# EasyEDA Pro project CameraTargetV3.eprj, schematic Schematic1
Create Date: 2023-05-23; Page Name: P1; Project Name: CameraTargetV3; Schematic Name: Schematic1; Update Date: 2023-05-31
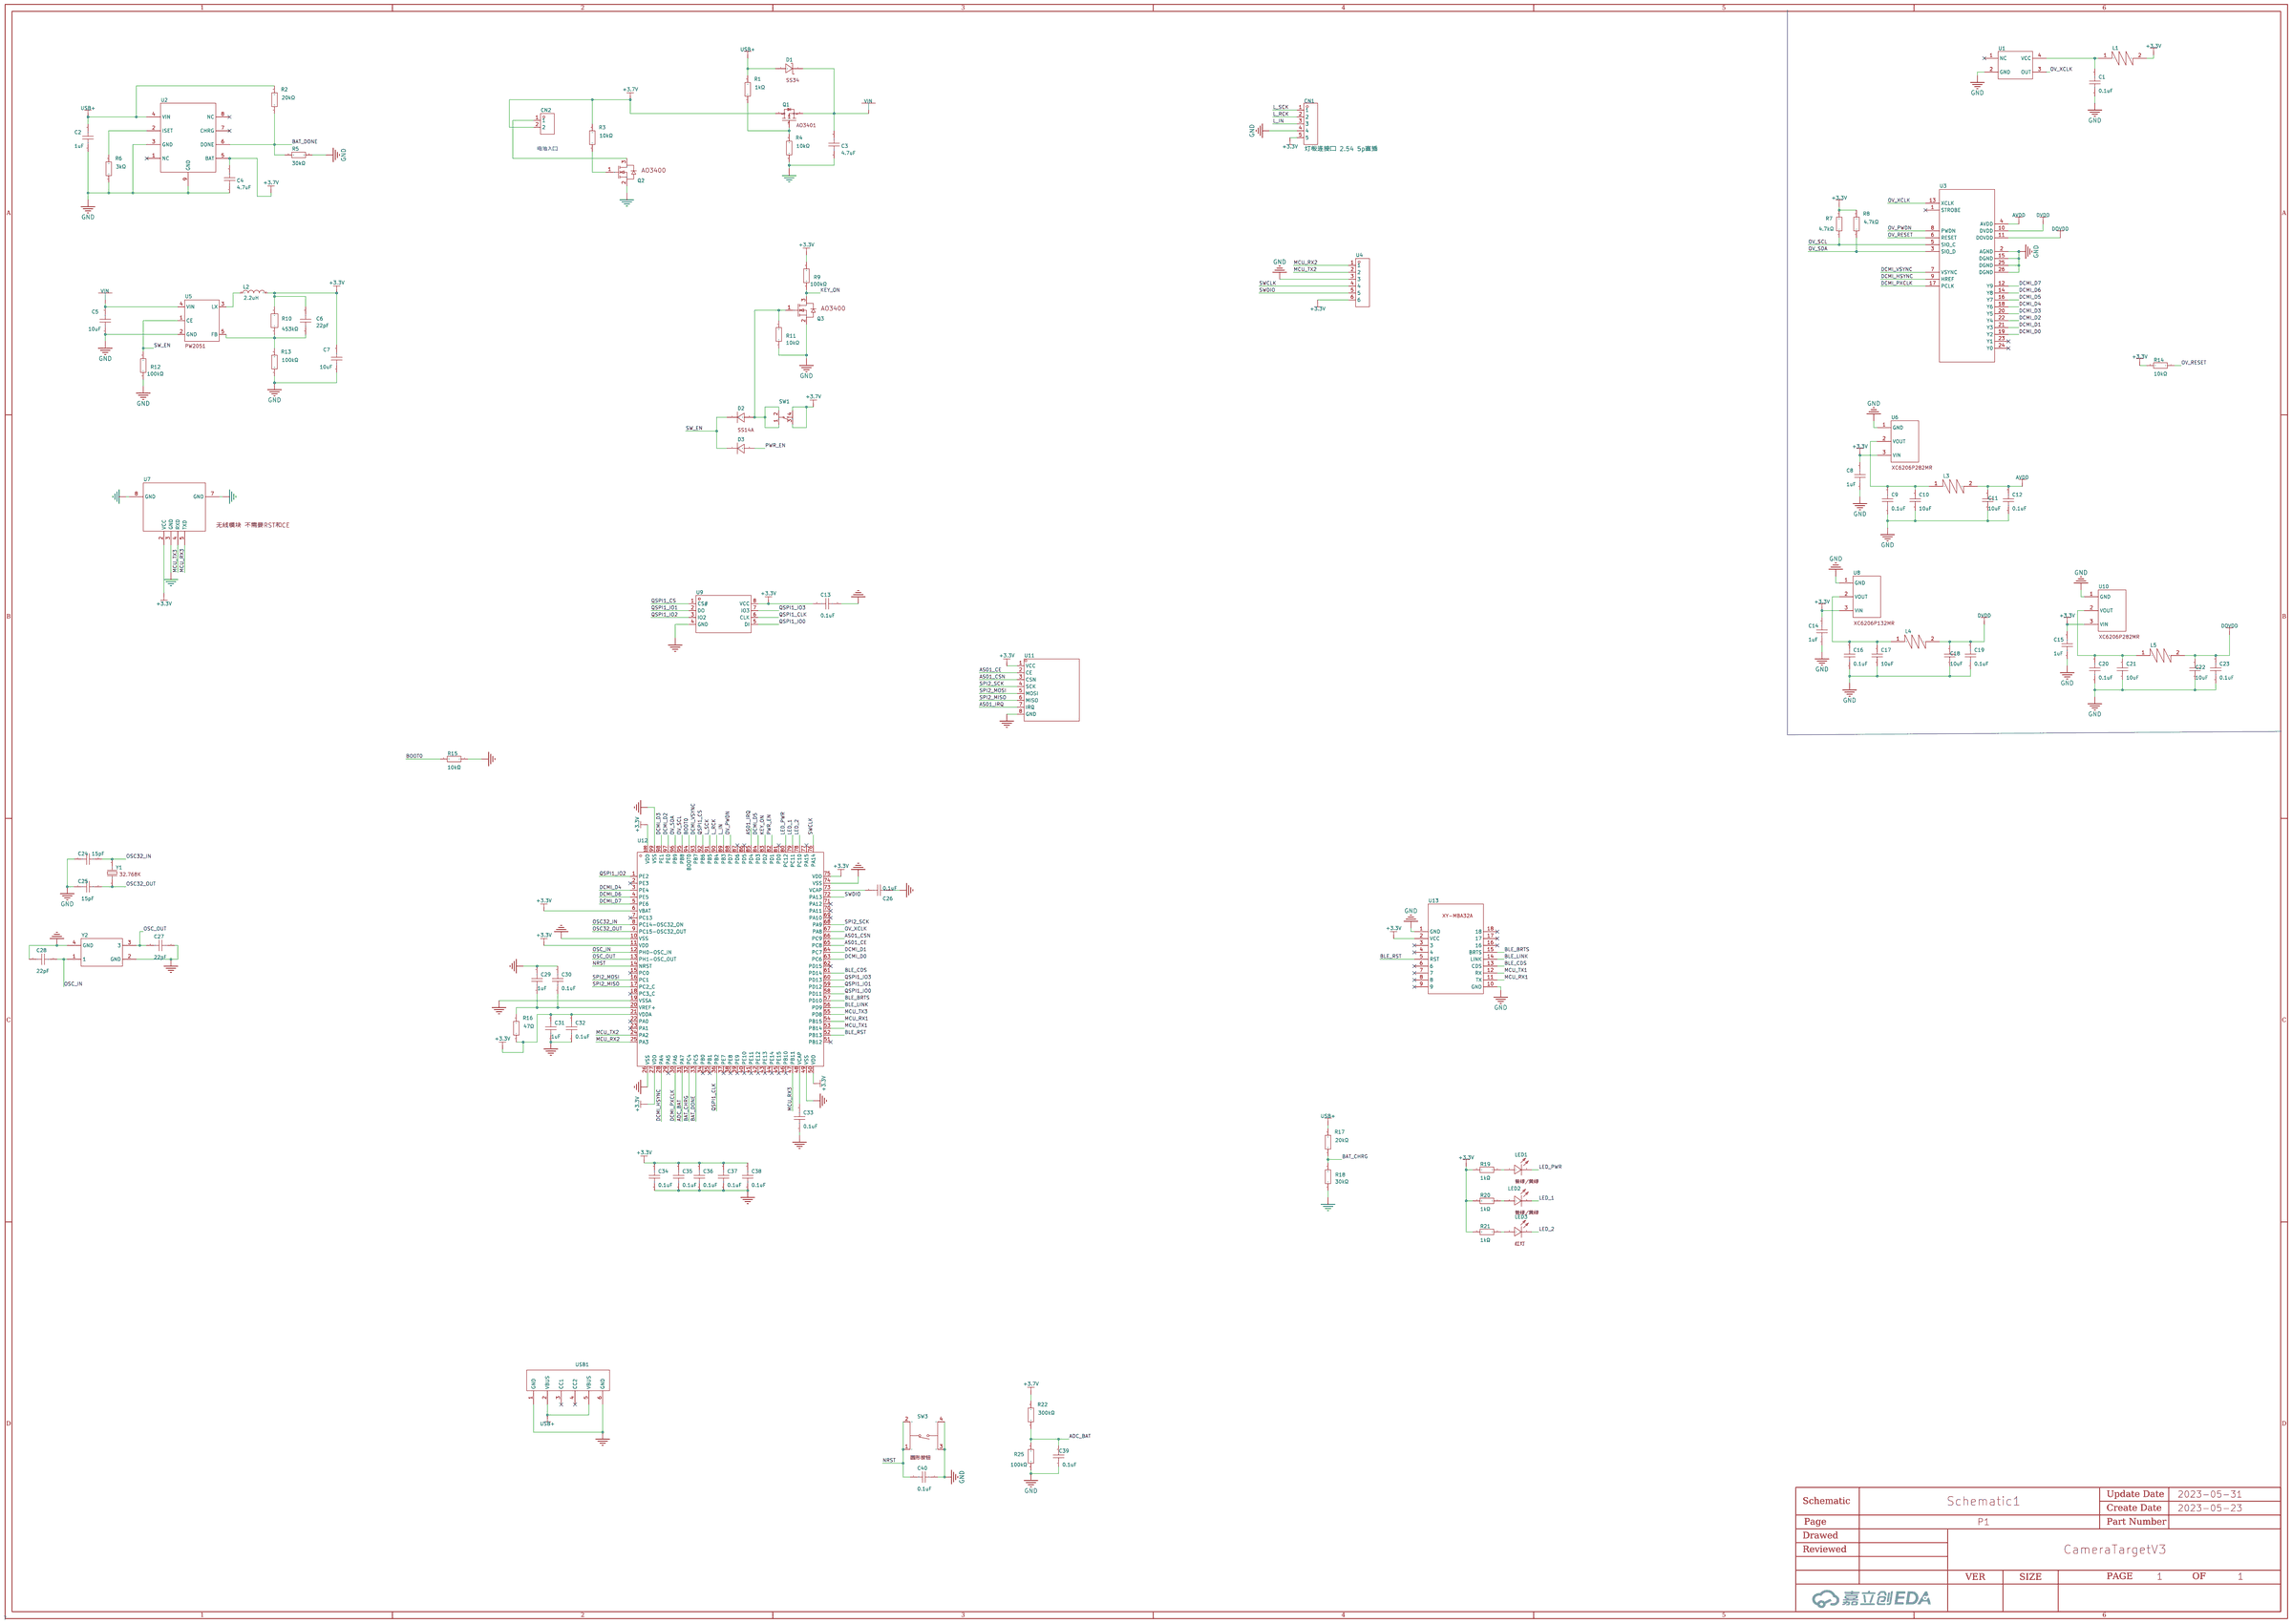
[diagram p0: schematic sheet]

## Parts
C1  0.1uF  [C0603]
C2  1uF  [C0603]
C3  4.7uF  [C0603]
C4  4.7uF  [C0603]
C5  10uF  [C0603]
C6  22pF  [C0603]
C7  10uF  [C0603]
C8  1uF  [C0603]
C9  0.1uF  [C0603]
C10  10uF  [C0603]
C11  10uF  [C0603]
C12  0.1uF  [C0603]
C13  0.1uF  [C0603]
C14  1uF  [C0603]
C15  1uF  [C0603]
C16  0.1uF  [C0603]
C17  10uF  [C0603]
C18  10uF  [C0603]
C19  0.1uF  [C0603]
C20  0.1uF  [C0603]
C21  10uF  [C0603]
C22  10uF  [C0603]
C23  0.1uF  [C0603]
C24  15pF  [C0603]
C25  15pF  [C0603]
C26  0.1uF  [C0603]
C27  22pF  [C0603]
C28  22pF  [C0603]
C29  1uF  [C0603]
C30  0.1uF  [C0603]
C31  1uF  [C0603]
C32  0.1uF  [C0603]
C33  0.1uF  [C0603]
C34  0.1uF  [C0603]
C35  0.1uF  [C0603]
C36  0.1uF  [C0603]
C37  0.1uF  [C0603]
C38  0.1uF  [C0603]
C39  0.1uF  [C0603]
C40  0.1uF  [C0603]
CN1  灯板连接口 2.54 5p直插  [CONN-TH_5P-P2.50_HX25003-5A]
CN2  HDGC2501WR-2P  [CONN-TH_2P-P2.50_HDGC2501WR-2P]
D1  -  [DO-214AC_L4.3-W2.7-LS5.3-RD]
D2  SS14A  [SMA_L4.3-W2.6-LS5.2-RD]
D3  SS14A  [SMA_L4.3-W2.6-LS5.2-RD]
L1  -  [0420]
L2  2.2uH  [IND-SMD_L4.0-W4.0_0.47UH04209.5A]
L3  -  [0420]
L4  -  [0420]
L5  -  [0420]
LED1  TLMG1100-GS08  [LED0603-R-RD_GREEN]
LED2  TLMG1100-GS08  [LED0603-R-RD_GREEN]
LED3  TLMS1000-GS08  [LED0603-R-RD]
Q1  -  [SOT-23-3_L2.9-W1.3-P1.90-LS2.4-BR]
Q2  AO3400  [SOT-23_L2.9-W1.3-P1.90-LS2.4-BR]
Q3  AO3400  [SOT-23_L2.9-W1.3-P1.90-LS2.4-BR]
R1  1kΩ  [R0603]
R2  20kΩ  [R0603]
R3  10kΩ  [R0603]
R4  10kΩ  [R0603]
R5  30kΩ  [R0603]
R6  3kΩ  [R0603]
R7  4.7kΩ  [R0603]
R8  4.7kΩ  [R0603]
R9  100kΩ  [R0603]
R10  453kΩ  [R0603]
R11  10kΩ  [R0603]
R12  100kΩ  [R0603]
R13  100kΩ  [R0603]
R14  10kΩ  [R0603]
R15  10kΩ  [R0603]
R16  47Ω  [R0603]
R17  20kΩ  [R0603]
R18  30kΩ  [R0603]
R19  1kΩ  [R0603]
R20  1kΩ  [R0603]
R21  1kΩ  [R0603]
R22  300kΩ  [R0603]
R25  100kΩ  [R0603]
SW1  -  [按钮开关]
SW3  1TS001G-2700-1500-CT  [SW-SMD_4P-L5.1-W5.1-P3.70-LS6.5-TL-2]
U1  -  [5032-4P]
U2  -  [PW4056]
U3  -  [OV2640]
U4  HDGC1501WV-6P  [CONN-TH_6P-P1.50_HDGC_HDGC1501WV-6P]
U5  -  [PW2051]
U6  -  [SOT-23-3_L2.9-W1.6-P1.90-LS2.9-BL]
U7  -  [GC2400-TC010R]
U8  -  [SOT-23-3_L2.9-W1.6-P1.90-LS2.9-BL]
U9  W25Q64JVSSIQ  [SOP-8_L5.3-W5.3-P1.27-LS8.0-BL]
U10  -  [SOT-23-3_L2.9-W1.6-P1.90-LS2.9-BL]
U11  AS01-ML01IPX  [WIRELM-SMD_8P-L19.0-W12.0-P1.27]
U12  STM32H7B0VBT6  [LQFP-100_L14.0-W14.0-P0.50-LS16.0-BL]
U13  -  [XY-MBA32A]
USB1  -  [typec]
Y1  -  [3215]
Y2  -  [XTAL3225]

## Library data of the parts
C1 C9 C12 C13 C16 C19 C20 C23 C26 C30 C32-C38 C40 = CC0603KRX7R9BB104: 容值:100nF;精度:±10%;额定电压:50V;材质(温度系数):X7R;; LCSC Part Name: 100nF ±10% 50V; Supplier Part: C14663; Manufacturer: YAGEO(国巨); Supplier Footprint: 0603; JLCPCB Part Class: Basic Part; Datasheet: https://atta.szlcsc.com/upload/public/pdf/source/20170116/1484561234239.pdf; Supplier: LCSC; Tolerance: ±10%; Voltage Rated: 50V; Temperature Coefficient: X7R
C2 C8 C14 C15 C29 C31 = CC0603KRX7R9BB105: 容值:1uF;精度:±10%;额定电压:50V;材质(温度系数):X7R;; LCSC Part Name: 1uF ±10% 50V; Supplier Part: C559769; Manufacturer: YAGEO(国巨); Supplier Footprint: 0603; JLCPCB Part Class: Extended Part; Datasheet: https://atta.szlcsc.com/upload/public/pdf/source/20181031/C325451_C7CF01155AE3010E0D610C52F5FE7D31.pdf; Supplier: LCSC; Tolerance: ±10%; Voltage Rated: 50V; Temperature Coefficient: X7R
C3 C4 = 0603X475M160NT: 容值:4.7uF;精度:±20%;额定电压:16V;温度系数:X5R;; LCSC Part Name: 4.7uF ±20% 16V; Supplier Part: C417282; Manufacturer: FH(风华); Supplier Footprint: 0603; JLCPCB Part Class: Extended Part; Datasheet: https://atta.szlcsc.com/upload/public/pdf/source/20190828/C417282_9FA89336CC150C49D68906F9E844F6E8.pdf; Supplier: LCSC; Tolerance: ±20%; Voltage Rated: 16V; Temperature Coefficient: X5R
C5 C7 = 0603X106M100CT: 容值:10uF;精度:±20%;额定电压:10V;温度系数:X5R;; LCSC Part Name: 10uF ±20% 10V; Supplier Part: C89283; Manufacturer: 华新科(Walsin); Supplier Footprint: 0603; JLCPCB Part Class: Extended Part; Datasheet: https://atta.szlcsc.com/upload/public/pdf/source/20161226/1482720147964.pdf; Supplier: LCSC; Tolerance: ±20%; Voltage Rated: 10V; Temperature Coefficient: X5R
C6 C27 C28 = 0603CG220F500NT: 容值:22pF;精度:±1%;额定电压:50V;温度系数:C0G;; LCSC Part Name: 22pF ±1% 50V; Supplier Part: C190086; Manufacturer: FH(风华); Supplier Footprint: 0603; JLCPCB Part Class: Extended Part; Datasheet: https://atta.szlcsc.com/upload/public/pdf/source/20180403/C190086_AE2857A36C77ED36CE0DF753AD1C79C3.pdf; Supplier: LCSC; Tolerance: ±1%; Voltage Rated: 50V; Temperature Coefficient: C0G
C10 C11 C17 C18 C21 C22 = 0603X106K160NT: 温度系数:X5R;精度:±10%;额定电压:16V;容值:10uF;; LCSC Part Name: 10uF(106) ±10% 16V; Supplier Part: C70225; Manufacturer: FH(风华); Supplier Footprint: 0603; JLCPCB Part Class: Extended Part; Datasheet: https://atta.szlcsc.com/upload/public/pdf/source/20170923/C70225_1506149537616988930.pdf; Supplier: LCSC; Temperature Coefficient: X5R; Tolerance: ±10%; Voltage Rated: 16V
C24 C25 = 0603CG150J500NT: 容值:15pF;精度:±5%;额定电压:50V;温度系数:C0G;; LCSC Part Name: 15pF ±5% 50V; Supplier Part: C91703; Manufacturer: FH(风华); Supplier Footprint: 0603; JLCPCB Part Class: Extended Part; Datasheet: https://atta.szlcsc.com/upload/public/pdf/source/20170105/1483610779016.pdf; Supplier: LCSC; Tolerance: ±5%; Voltage Rated: 50V; Temperature Coefficient: C0G
C39 = 0603B104K101CT: 容值:100nF;精度:±10%;额定电压:100V;温度系数:X7R;; LCSC Part Name: 100nF ±10% 100V; Supplier Part: C116838; Manufacturer: 华新科(Walsin); Supplier Footprint: 0603; JLCPCB Part Class: Extended Part; Datasheet: https://atta.szlcsc.com/upload/public/pdf/source/20190709/C116838_F1A9F4B47B8E555AD45D8607B90A094B.pdf; Supplier: LCSC; Tolerance: ±10%; Voltage Rated: 100V; Temperature Coefficient: X7R
CN1 = HX25003-5A: 参考系列:XH;间距:2.5mm;插针结构:1x5P;排数:1;每排PIN数:5;行距:-;公母:公型插针;安装方式:直插;额定电流:-;工作温度范围:-;; LCSC Part Name: XH 2.5mm 1x5P 直插; Supplier Part: C442302; Manufacturer: HX(红星); Supplier Footprint: 插件,P=2.5mm; JLCPCB Part Class: Extended Part; Datasheet: https://atta.szlcsc.com/upload/public/pdf/source/20191028/C442302_E66AD84792E19526D7353D56EEE1C29F.pdf; Supplier: LCSC; Reference Series: XH; Pitch: 2.5mm; Pins Structure: 1x5P; Number of Rows: 1; Number of PINs Per Row: 5; Gender: 公型插针; Mounting Style: 直插
CN2 = HDGC2501WR-2P: LCSC Part Name: XH2.5弯针 2P; Supplier Part: C5175255; Manufacturer: HDGC(华德共创); Supplier Footprint: 弯插,P=2.5mm; JLCPCB Part Class: Extended Part; Datasheet: https://atta.szlcsc.com/upload/public/pdf/source/20220916/C1717F8E2C78083BF9D63A459D48AEE1.pdf; Supplier: LCSC
D1 = SS34_C8678: 直流反向耐压(Vr):40V;平均整流电流(Io):3A;正向压降(Vf):550mV@3A;; LCSC Part Name: 40V 3A 550mV@3A; Supplier Part: C8678; Manufacturer: MDD; Manufacturer Part: SS34; Supplier Footprint: SMA(DO-214AC); JLCPCB Part Class: Basic Part; Datasheet: https://atta.szlcsc.com/upload/public/pdf/source/20210506/C15874_5BDBC70F665BA444FCE0210303DB2A89.pdf; Supplier: LCSC; Reverse Voltage (Vr): 40V; Average Rectified Current (Io): 3A; Forward Voltage (Vf@If): 550mV@3A
D2 D3 = SS14A: 直流反向耐压(Vr):40V;平均整流电流(Io):1A;正向压降(Vf):500mV@1A;; LCSC Part Name: 40V 1A 500mV@1A; Supplier Part: C211770; Manufacturer: YANGJIE(扬杰); Supplier Footprint: SMA(DO-214AC); JLCPCB Part Class: Extended Part; Datasheet: https://atta.szlcsc.com/upload/public/pdf/source/20180504/C211770_627C435F34E9C107E4A4301F69D28675.pdf; Supplier: LCSC; Reverse Voltage (Vr): 40V; Average Rectified Current (Io): 1A; Forward Voltage (Vf@If): 500mV@1A
L1 L3-L5 = 3.3uh电感
L2 = 2.2uh3a电感: 电感值:2.2uH;精度:±20%;额定电流:3A;直流电阻(DCR):-;; Rated Current: 3A; Supplier: LCSC; Supplier Part: C438930; Supplier Footprint: SMD; LCSC Part Name: 2.2uH ±20% 3A; Tolerance: ±20%; Manufacturer: Cybermax(思博科技); Manufacturer Part: CMLO0420H2R2MTT
LED1 LED2 = TLMG1100-GS08: 照明颜色:普绿/黄绿;色温 - CCT（K）:-;主波长/色坐标:570nm;; LCSC Part Name: 普绿/黄绿 0603; Supplier Part: C241891; Manufacturer: VISHAY(威世); Supplier Footprint: 0603; JLCPCB Part Class: Extended Part; Datasheet: https://atta.szlcsc.com/upload/public/pdf/source/20180719/C241891_3C76D4DD30CDE57601F75DEAAAECA69D.pdf; Supplier: LCSC; Mounting Type: 表面贴装; Illumination Color: 普绿/黄绿; Luminous Intensity (IF=20mA): 35mcd; Dominant Wavelength / Coordinate rank: 570nm
LED3 = TLMS1000-GS08: 发光颜色:红灯;; LCSC Part Name: 红灯; Supplier Part: C241893; Manufacturer: VISHAY(威世); Supplier Footprint: 0603; JLCPCB Part Class: Extended Part; Datasheet: https://atta.szlcsc.com/upload/public/pdf/source/20180719/C241893_4BC7C846B3C52AB2D39E337E84999DF0.pdf; Supplier: LCSC; Emitted Color: 红灯
Q1 = AO3401_C181091: 类型:P沟道;漏源电压(Vdss):30V;连续漏极电流(Id):4.2A;功率(Pd):350mW;导通电阻(RDS(on)@Vgs,Id):65mΩ@10V,4.2A;阈值电压(Vgs(th)@Id):1.3V@250A;; LCSC Part Name: P沟道 30V 4.2A; Supplier Part: C181091; Manufacturer: Hottech(合科泰); Manufacturer Part: AO3401; Supplier Footprint: SOT-23(SOT-23-3); JLCPCB Part Class: Extended Part; Datasheet: https://atta.szlcsc.com/upload/public/pdf/source/20180131/C181091_15173931948391329220.pdf; Supplier: LCSC; Type: P沟道; Drain Source Voltage (Vdss): 30V; Continuous Drain Current (Id): 4.2A; Power Dissipation (Pd): 350mW; Drain Source On Resistance (RDS(on)@Vgs,Id): 65mΩ@10V,4.2A; Gate Threshold Voltage (Vgs(th)@Id): 1.3V@250A
Q2 Q3 = AO3400: 类型:N沟道;漏源电压(Vdss):30V;连续漏极电流(Id):5.8A;功率(Pd):1.5W;导通电阻(RDS(on)@Vgs,Id):35mΩ@10V,5.8A;阈值电压(Vgs(th)@Id):1.2V@250uA;栅极电荷(Qg@Vgs):-;输入电容(Ciss@Vds):1050pF@15V;反向传输电容(Crss@Vds):77pF@15V;工作温度:+150@(Tj);; LCSC Part Name: N沟道 30V 5.8A; Supplier Part: C2938367; Manufacturer: GOODWORK(固得沃克); Supplier Footprint: SOT23; JLCPCB Part Class: Extended Part; Datasheet: https://atta.szlcsc.com/upload/public/pdf/source/20211229/1DE691E24B5B31BB262C463D0489A9AB.pdf; Supplier: LCSC; Type: N沟道; Drain Source Voltage (Vdss): 30V; Continuous Drain Current (Id): 5.8A; Power Dissipation (Pd): 1.5W; Drain Source On Resistance (RDS(on)@Vgs,Id): 35mΩ@10V,5.8A; Gate Threshold Voltage (Vgs(th)@Id): 1.2V@250uA; Input Capacitance (Ciss@Vds): 1050pF@15V; Reverse Transfer Capacitance (Crss@Vds): 77pF@15V; Operating Temperature: +150@(Tj)
R1 R19-R21 = 0603WAF1001T5E: 电阻类型:厚膜电阻;阻值:1kΩ;精度:±1%;功率:100mW;; LCSC Part Name: 1kΩ ±1% 100mW; Supplier Part: C21190; Manufacturer: UNI-ROYAL(厚声); Supplier Footprint: 0603; JLCPCB Part Class: Basic Part; Datasheet: https://atta.szlcsc.com/upload/public/pdf/source/20200306/C422600_1E6D84923E4A46A82E41ADD87F860B5C.pdf; Supplier: LCSC; Type: 厚膜电阻; Tolerance: ±1%; Power(Watts): 100mW; Temperature Coefficient: ±100ppm/; Overload Voltage (Max): 75V; Operating Temperature Range: -55~+155
R2 R17 = 0603WAF2002T5E: 电阻类型:厚膜电阻;阻值:20kΩ;精度:±1%;功率:100mW;; LCSC Part Name: 20kΩ ±1% 100mW; Supplier Part: C4184; Manufacturer: UNI-ROYAL(厚声); Supplier Footprint: 0603; JLCPCB Part Class: Basic Part; Datasheet: https://atta.szlcsc.com/upload/public/pdf/source/20200306/C422600_1E6D84923E4A46A82E41ADD87F860B5C.pdf; Supplier: LCSC; Type: 厚膜电阻; Tolerance: ±1%; Power(Watts): 100mW; Temperature Coefficient: ±100ppm/; Overload Voltage (Max): 75V; Operating Temperature Range: -55~+155
R3 R4 R11 R14 R15 = 0603WAF1002T5E: 电阻类型:厚膜电阻;阻值:10kΩ;精度:±1%;功率:100mW;; LCSC Part Name: 厚膜电阻 10kΩ ±1% 100mW; Supplier Part: C25804; Manufacturer: UNI-ROYAL(厚声); Supplier Footprint: 0603; JLCPCB Part Class: Basic Part; Datasheet: https://atta.szlcsc.com/upload/public/pdf/source/20200306/C422600_1E6D84923E4A46A82E41ADD87F860B5C.pdf; Supplier: LCSC; Type: 厚膜电阻; Tolerance: ±1%; Power(Watts): 100mW; Temperature Coefficient: ±100ppm/; Overload Voltage (Max): 75V; Operating Temperature Range: -55~+155
R5 R18 = 0603WAF3002T5E: 电阻类型:厚膜电阻;阻值:30kΩ;精度:±1%;功率:100mW;; LCSC Part Name: 30kΩ ±1% 100mW; Supplier Part: C22984; Manufacturer: UNI-ROYAL(厚声); Supplier Footprint: 0603; JLCPCB Part Class: Basic Part; Datasheet: https://atta.szlcsc.com/upload/public/pdf/source/20200306/C422600_1E6D84923E4A46A82E41ADD87F860B5C.pdf; Supplier: LCSC; Type: 厚膜电阻; Tolerance: ±1%; Power(Watts): 100mW; Temperature Coefficient: ±100ppm/; Overload Voltage (Max): 75V; Operating Temperature Range: -55~+155
R6 = 0603WAF3001T5E: 电阻类型:厚膜电阻;阻值:3kΩ;精度:±1%;功率:100mW;; LCSC Part Name: 3kΩ ±1% 100mW; Supplier Part: C4211; Manufacturer: UNI-ROYAL(厚声); Supplier Footprint: 0603; JLCPCB Part Class: Basic Part; Datasheet: https://atta.szlcsc.com/upload/public/pdf/source/20200306/C422600_1E6D84923E4A46A82E41ADD87F860B5C.pdf; Supplier: LCSC; Type: 厚膜电阻; Tolerance: ±1%; Power(Watts): 100mW; Temperature Coefficient: ±100ppm/; Overload Voltage (Max): 75V; Operating Temperature Range: -55~+155
R7 R8 = 0603WAF4701T5E: 电阻类型:厚膜电阻;阻值:4.7kΩ;精度:±1%;功率:100mW;; LCSC Part Name: 4.7kΩ ±1% 100mW; Supplier Part: C23162; Manufacturer: UNI-ROYAL(厚声); Supplier Footprint: 0603; JLCPCB Part Class: Basic Part; Datasheet: https://atta.szlcsc.com/upload/public/pdf/source/20200306/C422600_1E6D84923E4A46A82E41ADD87F860B5C.pdf; Supplier: LCSC; Type: 厚膜电阻; Tolerance: ±1%; Power(Watts): 100mW; Temperature Coefficient: ±100ppm/; Overload Voltage (Max): 75V; Operating Temperature Range: -55~+155
R9 R12 R13 R25 = 0603WAF1003T5E: 电阻类型:厚膜电阻;阻值:100kΩ;精度:±1%;功率:100mW;; LCSC Part Name: 100kΩ ±1% 100mW; Supplier Part: C25803; Manufacturer: UNI-ROYAL(厚声); Supplier Footprint: 0603; JLCPCB Part Class: Basic Part; Datasheet: https://atta.szlcsc.com/upload/public/pdf/source/20200306/C422600_1E6D84923E4A46A82E41ADD87F860B5C.pdf; Supplier: LCSC; Type: 厚膜电阻; Tolerance: ±1%; Power(Watts): 100mW; Temperature Coefficient: ±100ppm/; Overload Voltage (Max): 75V; Operating Temperature Range: -55~+155
R10 = RC0603FR-07453KL: 电阻类型:厚膜电阻;阻值:453kΩ;精度:±1%;功率:100mW;; LCSC Part Name: 453kΩ ±1% 100mW; Supplier Part: C273765; Manufacturer: YAGEO(国巨); Supplier Footprint: 0603; JLCPCB Part Class: Extended Part; Datasheet: https://atta.szlcsc.com/upload/public/pdf/source/20191125/C273765_7C421A3A285B90E1F65B5105C399ED72.pdf; Supplier: LCSC; Type: 厚膜电阻; Tolerance: ±1%; Power(Watts): 100mW; Temperature Coefficient: ±100ppm/; Overload Voltage (Max): 75V; Operating Temperature Range: -55~+155
R16 = 0603WAF470JT5E: 电阻类型:厚膜电阻;阻值:47Ω;精度:±1%;功率:100mW;; LCSC Part Name: 47Ω ±1% 100mW; Supplier Part: C23182; Manufacturer: UNI-ROYAL(厚声); Supplier Footprint: 0603; JLCPCB Part Class: Basic Part; Datasheet: https://atta.szlcsc.com/upload/public/pdf/source/20200306/C422600_1E6D84923E4A46A82E41ADD87F860B5C.pdf; Supplier: LCSC; Type: 厚膜电阻; Tolerance: ±1%; Power(Watts): 100mW; Temperature Coefficient: ±100ppm/; Overload Voltage (Max): 75V; Operating Temperature Range: -55~+155
R22 = 0603WAF3003T5E: 电阻类型:厚膜电阻;阻值:300kΩ;精度:±1%;功率:100mW;; LCSC Part Name: 300kΩ ±1% 100mW; Supplier Part: C23024; Manufacturer: UNI-ROYAL(厚声); Supplier Footprint: 0603; JLCPCB Part Class: Basic Part; Datasheet: https://atta.szlcsc.com/upload/public/pdf/source/20200306/C422600_1E6D84923E4A46A82E41ADD87F860B5C.pdf; Supplier: LCSC; Type: 厚膜电阻; Tolerance: ±1%; Power(Watts): 100mW; Temperature Coefficient: ±100ppm/; Overload Voltage (Max): 75V; Operating Temperature Range: -55~+155
SW1 = 按键开关
SW3 = 1TS001G-2700-1500-CT: 触点电流:20mA;额定电压(DC):12V;电路结构:单刀单掷;安装方式:立贴;按钮形状:圆形按钮;带灯:-;开关长度:5.1mm;开关宽度:5.1mm;开关高度:0.3mm;; LCSC Part Name: 铜头按钮; Supplier Part: C318800; Manufacturer: HYP(鸿源精密); Supplier Footprint: SMD,5.1x5.1mm; JLCPCB Part Class: Extended Part; Datasheet: https://atta.szlcsc.com/upload/public/pdf/source/20200109/C318800_E3EE45BECD3EEEC6701309AC007B685B.pdf; Supplier: LCSC; Contact Current: 20mA; Voltage Rating (DC): 12V; Circuit: 单刀单掷; Mounting Style: 立贴; Actuator Style: 圆形按钮; Switch Length: 5.1mm; Switch Width: 5.1mm; Switch Height: 0.3mm
U1 = 24M有源晶振
U2 = PW4056: 带OVP充电芯片
U3 = 相机排座: NO_CONNECT: yes
U4 = HDGC1501WV-6P: LCSC Part Name: ZH1.5直针 6P; Supplier Part: C5175216; Manufacturer: HDGC(华德共创); Supplier Footprint: 直插,P=1.5mm; Datasheet: https://atta.szlcsc.com/upload/public/pdf/source/20220916/0E4647A3A85E9D7CFB69507DE86E8F95.pdf; Supplier: LCSC
U5 = PW2051: Supplier: LCSC; Supplier Part: C9900004763; Supplier Footprint: SOT23-5; JLCPCB Part Class: Extended Part; Datasheet: 2021-12-24/856123Z/fbe1facec1e64a42b88c21fe7c936e8d/PW2051.pdf
U6 U10 = 电压芯片共用: XC6206P282MR
U7 = GC2400-TC010R: 无线模块 不需要RST和CE; NO_CONNECT: yes
U8 = 电压芯片共用: XC6206P132MR
U9 = W25Q64JVSSIQ_C83140: 64M-bit/8M-byte FLASH芯片,SPI接口 133MHz(266/532MHz Dual/Quad-SPI) 比W25Q64FVSSIG更高速度; Supplier Part: C83140; Manufacturer: WINBOND(华邦); Supplier Footprint: SOP-8-208mil; JLCPCB Part Class: Extended Part; Datasheet: https://atta.szlcsc.com/upload/public/pdf/source/20161110/1478742546019.pdf; Supplier: LCSC
U11 = AS01-ML01IPX: NRF24L01P无线模块 SPI通信; Supplier Part: C89508; Manufacturer: Ashining(泽耀科技); Supplier Footprint: SMD; JLCPCB Part Class: Extended Part; Datasheet: https://atta.szlcsc.com/upload/public/pdf/source/20180423/C89508_2FC7CA24D6819A879B6CB40B1DC4CAA0.pdf; Supplier: LCSC
U12 = STM32H7B0VBT6: CPU内核:ARM Cortex-M7;CPU最大主频:280MHz;工作电压范围:1.62V~3.6V;内部振荡器:有;程序 FLASH容量:128K@x8bit;RAM总容量:1.4MB;EEPROM/数据 FLASH容量:-;GPIO端口数量:80;ADC(单元数/通道数/位数):1@x16ch/16bit;DAC(单元数/通道数/位数):1@x3ch/12bit;外设/功能/协议栈:欠压检测/复位；DMA；LCD驱动；看门狗；POR；PWM;工作温度范围:-40~+85;; LCSC Part Name: ARM Cortex-M7 280MHz 闪存：128K@x8bit RAM：1.4MB; Supplier Part: C730227; Manufacturer: ST(意法半导体); Supplier Footprint: LQFP-100; JLCPCB Part Class: Extended Part; Datasheet: https://atta.szlcsc.com/upload/public/pdf/source/20200902/C730225_664883C886B4E760FDC927233147DBDC.pdf; Supplier: LCSC; CPU Core: ARM Cortex-M7; Maximum Frequency: 280MHz; Supply Voltage Range: 1.62V~3.6V; Internal Oscillator: 有; Program FLASH Size: 128K@x8bit; RAM Size: 1.4MB; GPIO Ports Number: 80; ADC (Units/Channels/bits): 1@x16ch/16bit; DAC (Units/Channels/bits): 1@x3ch/12bit; Peripherals / Functions / Protocol Stacks: 欠压检测/复位；DMA；LCD驱动；看门狗；POR；PWM; Operating Temperature Range: -40~+85
U13 = XY-MBA32A: 蓝牙5.2
USB1 = typec: type c接口
Y1 = 32.768KHz晶振: 32.768K
Y2 = 25MHz无源晶振: 3225

## Nets
+3.3V: C6.1 C7.2 C8.2 C13.2 C14.2 C15.2 C31.2 C32.2 C34.2 C35.2 C36.2 C37.2 C38.2 CN1.5 L1.2 L2.2 R7.2 R8.2 R9.2 R10.2 R14.2 R16.1 R19.2 R20.2 R21.2 U4.6 U6.3(VIN) U7.2(VCC) U8.3(VIN) U9.8(VCC) U10.3(VIN) U11.1(VCC) U12.6(VBAT) U12.11(VDD) U12.21(VDDA) U12.27(VDD) U12.50(VDD) U12.75(VDD) U12.100(VDD) U13.2(VCC)
+3.7V: C4.2 CN2.2 Q1.3(D) R3.2 R22.2 SW1.3(C) SW1.4(D) U2.5(BAT)
AVDD: C11.2 C12.2 L3.2 U3.4(AVDD)
DVDD: C18.2 C19.2 L4.2 U3.10(DVDD)
GND: C1.1 C2.1 C3.1 C4.1 C5.1 C7.1 C8.1 C9.1 C10.1 C11.1 C12.1 C13.1 C14.1 C15.1 C16.1 C17.1 C18.1 C19.1 C20.1 C21.1 C22.1 C23.1 C24.1 C25.1 C26.1 C27.1 C28.2 C29.2 C30.2 C31.1 C32.1 C33.1 C34.1 C35.1 C36.1 C37.1 C38.1 C39.1 C40.1 CN1.4 Q2.2(S) Q3.2(S) R4.1 R5.2 R6.1 R11.1 R12.1 R13.1 R15.1 R18.1 R25.2 SW3.3(C) SW3.4(D) U1.2(GND) U2.3(GND) U2.9(GND) U3.2(AGND) U3.15(DGND) U3.25(DGND) U3.26(DGND) U4.3 U5.2(GND) U6.1(GND) U7.3(GND) U7.7(GND) U7.8(GND) U8.1(GND) U9.4(GND) U10.1(GND) U11.8(GND) U12.10(VSS) U12.19(VSSA) U12.26(VSS) U12.49(VSS) U12.74(VSS) U12.99(VSS) U13.1(GND) U13.10(GND) USB1.1(GND) USB1.6(GND) Y2.2(GND) Y2.4(GND)
VIN: C3.2 C5.2 D1.1(K) Q1.2(S) U5.4(VIN)
ADC_BAT: C39.2 R22.1 R25.1 U12.31(PA7)
AS01_CE: U11.2(CE) U12.65(PC8)
AS01_CSN: U11.3(CSN) U12.66(PC9)
AS01_IRQ: U11.7(IRQ) U12.85(PD4)
BAT_CHRG: R17.1 R18.2 U12.32(PC4)
BAT_DONE: R2.1 R5.1 U2.6(DONE) U12.33(PC5)
BLE_BRTS: U12.57(PD10) U13.15(BRTS)
BLE_CDS: U12.61(PD14) U13.13(CDS)
BLE_LINK: U12.56(PD9) U13.14(LINK)
BLE_RST: U12.52(PB13) U13.5(RST)
BOOT0: R15.2 U12.94(BOOT0)
DCMI_D0: U3.19(Y2) U12.63(PC6)
DCMI_D1: U3.21(Y3) U12.64(PC7)
DCMI_D2: U3.22(Y4) U12.97(PE0)
DCMI_D3: U3.20(Y5) U12.98(PE1)
DCMI_D4: U3.18(Y6) U12.3(PE4)
DCMI_D5: U3.16(Y7) U12.84(PD3)
DCMI_D6: U3.14(Y8) U12.4(PE5)
DCMI_D7: U3.12(Y9) U12.5(PE6)
DCMI_HSYNC: U3.9(HREF) U12.28(PA4)
DCMI_PXCLK: U3.17(PCLK) U12.30(PA6)
DCMI_VSYNC: U3.7(VSYNC) U12.93(PB7)
DOVDD: C22.2 C23.2 L5.2 U3.11(DOVDD)
KEY_ON: Q3.3(D) R9.1 U12.83(PD2)
L_IN: CN1.3 U12.89(PB3)
L_RCK: CN1.2 U12.90(PB4)
L_SCK: CN1.1 U12.91(PB5)
LED_1: LED2.2(K) U12.79(PC11)
LED_2: LED3.2(K) U12.78(PC10)
LED_PWR: LED1.2(K) U12.80(PC12)
MCU_RX1: U12.54(PB15) U13.11(TX)
MCU_RX2: U4.1 U12.25(PA3)
MCU_RX3: U7.5(TXD) U12.47(PB11)
MCU_TX1: U12.53(PB14) U13.12(RX)
MCU_TX2: U4.2 U12.24(PA2)
MCU_TX3: U7.4(RXD) U12.55(PD8)
NRST: C40.2 SW3.1(A) SW3.2(B) U12.14(NRST)
OSC32_IN: C24.2 U12.8(PC14-OSC32_ON) Y1.2
OSC32_OUT: C25.2 U12.9(PC15-OSC32_OUT) Y1.1
OSC_IN: C28.1 U12.12(PH0-OSC_IN) Y2.1
OSC_OUT: C27.2 U12.13(PH1-OSC_OUT) Y2.3
OV_PWDN: U3.8(PWDN) U12.88(PD7)
OV_RESET: R14.1 U3.6(RESET)
OV_SCL: R7.1 U3.5(SIO_C) U12.95(PB8)
OV_SDA: R8.1 U3.3(SIO_D) U12.96(PB9)
OV_XCLK: U1.3(OUT) U3.13(XCLK) U12.67(PA8)
PWR_EN: D3.2(A) U12.82(PD1)
QSPI1_CLK: U9.6(CLK) U12.36(PB2)
QSPI1_CS: U9.1(CS#) U12.92(PB6)
QSPI1_IO0: U9.5(DI) U12.58(PD11)
QSPI1_IO1: U9.2(DO) U12.59(PD12)
QSPI1_IO2: U9.3(IO2) U12.1(PE2)
QSPI1_IO3: U9.7(IO3) U12.60(PD13)
SPI2_MISO: U11.6(MISO) U12.17(PC2_C)
SPI2_MOSI: U11.5(MOSI) U12.16(PC1)
SPI2_SCK: U11.4(SCK) U12.68(PA9)
SW_EN: D2.1(C) D3.1(C) R12.2 U5.1(CE)
SWCLK: U4.4 U12.76(PA14)
SWDIO: U4.5 U12.72(PA13)
USB+: C2.2 D1.2(A) R1.2 R2.2 R17.2 U2.4(VIN) USB1.2(VBUS) USB1.5(VBUS)
$1N3281: C1.2 L1.1 U1.4(VCC)
$1N3289: C9.2 C10.2 L3.1 U6.2(VOUT)
$1N3295: C16.2 C17.2 L4.1 U8.2(VOUT)
$1N3300: C20.2 C21.2 L5.1 U10.2(VOUT)
$1N7419: C33.2 U12.48(VCAP)
$1N8735: C26.2 U12.73(VCAP)
$1N15961: C29.1 C30.1 R16.2 U12.20(VREF+)
$1N19313: R6.2 U2.2(ISET)
$1N20232: Q1.1(G) R1.1 R4.2
$1N20234: Q2.1(G) R3.1
$1N20239: CN2.1 Q2.3(D)
$1N31759: L2.1 U5.3(LX)
$1N31762: C6.2 R10.1 R13.2 U5.5(FB)
$1N33058: D2.2(A) Q3.1(G) R11.2 SW1.1(A) SW1.2(B)
$1N33798: LED1.1(A) R19.1
$1N33800: LED2.1(A) R20.1
$1N33801: LED3.1(A) R21.1

Not connected (* = marked no-connect by the designer): U1 1(NC)*; U2 1(NC)* 7(CHRG)* 8(NC)*; U3 1(STROBE)* 23(Y1)* 24(Y0)*; U12 2(PE3)* 7(PC13)* 15(PC0)* 18(PC3_C)* 22(PA0)* 23(PA1)* 29(PA5)* 34(PB0)* 35(PB1)* 37(PE7)* 38(PE8)* 39(PE9)* 40(PE10)* 41(PE11)* 42(PE12)* 43(PE13)* 44(PE14)* 45(PE15)* 46(PB10)* 51(PB12)* 62(PD15)* 69(PA10)* 70(PA11)* 71(PA12)* 77(PA15)* 81(PD0)* 86(PD5)* 87(PD6)*; U13 3* 4* 6* 7* 8* 9* 16* 17* 18*; USB1 3(CC1)* 4(CC2)*

## Notes on the sheet
- 电池入口
